# Altium schematic sheet ESC_V1.SchDoc: Electronic Speed Controller V1
size 381 x 241 mm; Date: 7 Maret 2025; Author: Ahmad Hanif Abiyyu Khrisna; DrawnBy: Ahmad Hanif Abiyyu Khrisna; Organization: PENS; SheetNumber: 1; SheetTotal: 1; SheetBerapa: 1; DariTotalSheet: 1; SizeKertas: A3
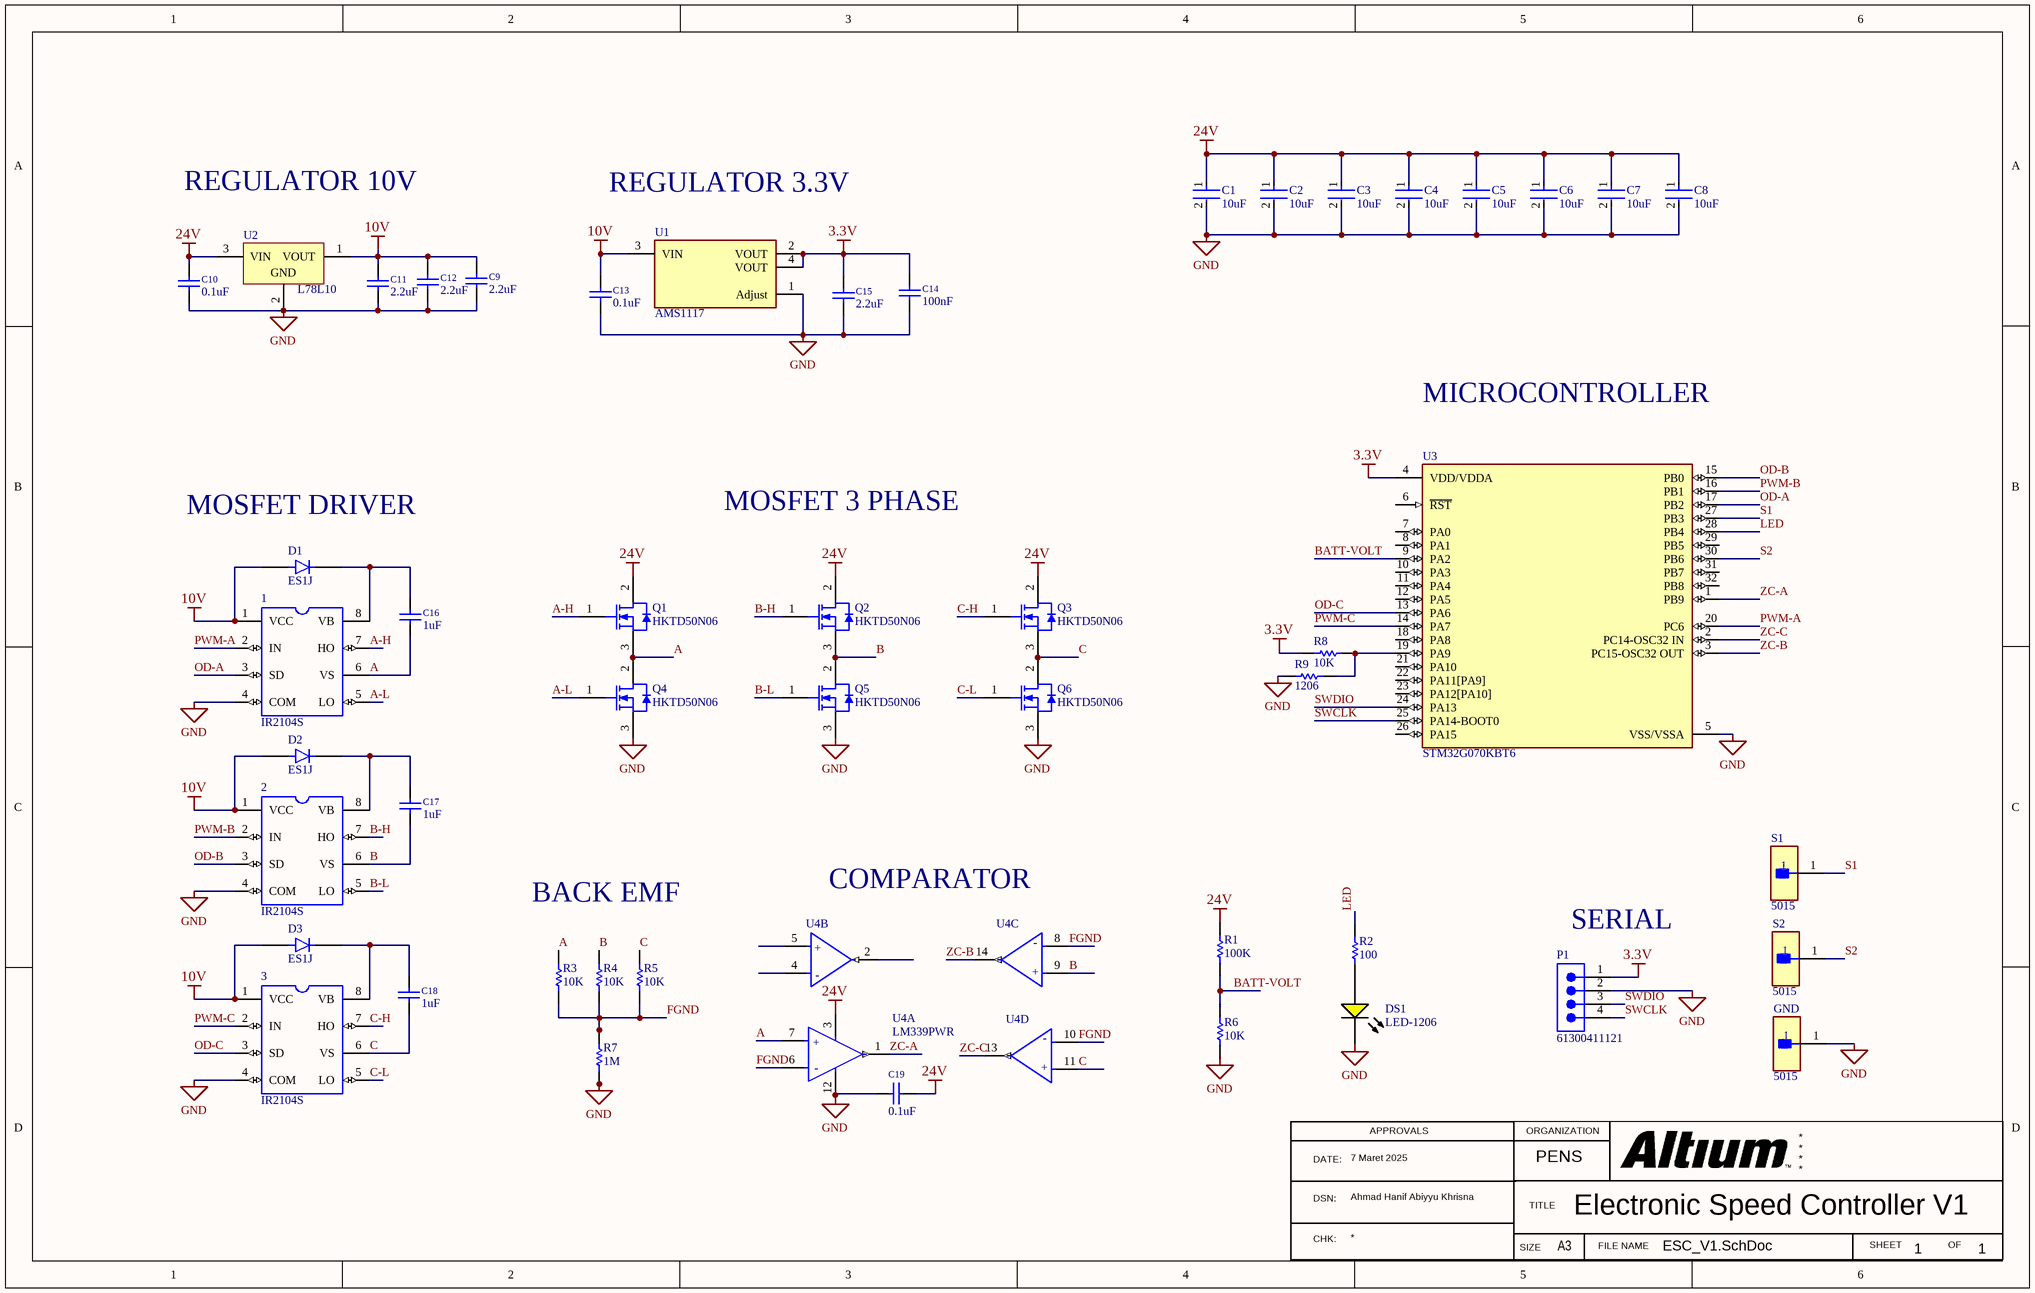
[diagram p0: ESC_V1.SchDoc]

## Parts
1  IR2104S  [IR2104S]
2  IR2104S  [IR2104S]
3  IR2104S  [IR2104S]
C1  10uF  [FP-C1206C-EB-IPC_A]
C2  10uF  [FP-C1206C-EB-IPC_A]
C3  10uF  [FP-C1206C-EB-IPC_A]
C4  10uF  [FP-C1206C-EB-IPC_A]
C5  10uF  [FP-C1206C-EB-IPC_A]
C6  10uF  [FP-C1206C-EB-IPC_A]
C7  10uF  [FP-C1206C-EB-IPC_A]
C8  10uF  [FP-C1206C-EB-IPC_A]
C9  2.2uF  [C2012-0805]
C10  0.1uF  [C2012-0805]
C11  2.2uF  [C2012-0805]
C12  2.2uF  [C2012-0805]
C13  0.1uF  [C2012-0805]
C14  100nF  [C2012-0805]
C15  2.2uF  [C2012-0805]
C16  1uF  [C2012-0805]
C17  1uF  [C2012-0805]
C18  1uF  [C2012-0805]
C19  0.1uF  [C2012-0805]
D1  ES1J  [DIO_ES1J]
D2  ES1J  [DIO_ES1J]
D3  ES1J  [DIO_ES1J]
DS1  LED-1206  [LUMX-SML-LX1206YC-TR_V]
GND  5015  [FP-5015-MFG]
P1  61300411121  [61300411121]
Q1  HKTD50N06  [INF-PG-TO252-3-313_L]
Q2  HKTD50N06  [INF-PG-TO252-3-313_L]
Q3  HKTD50N06  [INF-PG-TO252-3-313_L]
Q4  HKTD50N06  [INF-PG-TO252-3-313_L]
Q5  HKTD50N06  [INF-PG-TO252-3-313_L]
Q6  HKTD50N06  [INF-PG-TO252-3-313_L]
R1  100K  [RESC2013X50X30NL20T20]
R2  100  [RESC3216X70X50NL05T20]
R3  10K  [RESC2013X50X30NL20T20]
R4  10K  [RESC2013X50X30NL20T20]
R5  10K  [RESC2013X50X30NL20T20]
R6  10K  [RESC2013X50X30NL20T20]
R7  1M  [RESC2013X50X30NL20T20]
R8  10K  [RESC2013X50X30NL20T20]
R9  1206  [RESC3216X70X50NL05T20]
S1  5015  [FP-5015-MFG]
S2  5015  [FP-5015-MFG]
U1  AMS1117  [FP-ams1117-IPC_B]
U2  L78L10  [SOT-89_M]
U3  STM32G070KBT6  [FP-LQFP32-5V-MFG]
U4  LM339PWR  [FP-PW0014A-IPC_A]  (parts A,B,C,D of 4)

## Nets
3.3V: C14.1 C15.1 P1.1 R8.2 U1.2(VOUT) U1.4(VOUT) U3.4(VDD/VDDA)
10V: 1.1(VCC) 2.1(VCC) 3.1(VCC) C9.1 C11.1 C12.1 C13.1 D1.A D2.A D3.A U1.3(VIN) U2.1(VOUT)
24V: C1.1 C2.1 C3.1 C4.1 C5.1 C6.1 C7.1 C8.1 C10.1 C19.1 Q1.2(DRAIN) Q2.2(DRAIN) Q3.2(DRAIN) R1.2 U2.3(VIN) U4.3(VCC)
GND: 1.4(COM) 2.4(COM) 3.4(COM) C1.2 C2.2 C3.2 C4.2 C5.2 C6.2 C7.2 C8.2 C9.2 C10.2 C11.2 C12.2 C13.2 C14.2 C15.2 C19.2 DS1.2(K) GND.1 P1.2 Q4.3(SOURCE) Q5.3(SOURCE) Q6.3(SOURCE) R6.1 R7.1 R9.1 U1.1(Adjust) U2.2(GND) U3.5(VSS/VSSA) U4.12(GND)
A: 1.6(VS) C16.2 Q1.3(SOURCE) Q4.2(DRAIN) R3.2 U4.7(1IN+)
A-H: 1.7(HO) Q1.1(GATE)
A-L: 1.5(LO) Q4.1(GATE)
B: 2.6(VS) C17.2 Q2.3(SOURCE) Q5.2(DRAIN) R4.2 U4.9(3IN+)
B-H: 2.7(HO) Q2.1(GATE)
B-L: 2.5(LO) Q5.1(GATE)
BATT-VOLT: R1.1 R6.2 U3.9(PA2)
C: 3.6(VS) C18.2 Q3.3(SOURCE) Q6.2(DRAIN) R5.2 U4.11(4IN+)
C-H: 3.7(HO) Q3.1(GATE)
C-L: 3.5(LO) Q6.1(GATE)
FGND: R3.1 R4.1 R5.1 R7.2 U4.6(1IN-) U4.8(3IN-) U4.10(4IN-)
LED: R2.2 U3.28(PB4)
OD-A: 1.3(SD) U3.17(PB2)
OD-B: 2.3(SD) U3.15(PB0)
OD-C: 3.3(SD) U3.13(PA6)
PWM-A: 1.2(IN) U3.20(PC6)
PWM-B: 2.2(IN) U3.16(PB1)
PWM-C: 3.2(IN) U3.14(PA7)
S1: S1.1 U3.27(PB3)
S2: S2.1 U3.30(PB6)
SWCLK: P1.4 U3.25(PA14-BOOT0)
SWDIO: P1.3 U3.24(PA13)
ZC-A: U3.1(PB9) U4.1(1OUT)
ZC-B: U3.3(PC15-OSC32_OUT) U4.14(OUT3)
ZC-C: U3.2(PC14-OSC32_IN) U4.13(OUT4)
Net1_8: 1.8(VB) C16.1 D1.K
Net2_8: 2.8(VB) C17.1 D2.K
Net3_8: 3.8(VB) C18.1 D3.K
NetDS1_1: DS1.1(A) R2.1
NetR8_1: R8.1 R9.2 U3.19(PA9)

Not connected (* = marked no-connect by the designer): U3 6(~{RST}) 7(PA0) 8(PA1) 10(PA3) 11(PA4) 12(PA5) 18(PA8) 21(PA10) 22(PA11[PA9]) 23(PA12[PA10]) 26(PA15) 29(PB5) 31(PB7) 32(PB8); U4 2(2OUT) 4(2IN-) 5(2IN+)

## Notes on the sheet
- REGULATOR 10V
- REGULATOR 3.3V
- MICROCONTROLLER
- (near D1) MOSFET DRIVER
- MOSFET 3 PHASE
- BACK EMF
- (near U4) COMPARATOR
- (near P1) SERIAL
- DATE:
- APPROVALS
- ORGANIZATION
- DSN:
- CHK:
- SIZE
- TITLE
- FILE NAME
- SHEET
- OF
- (in symbol CMP-04896-000076-1, part A) +; -
- (in symbol CMP-04896-000076-1, part B) +; -
- (in symbol CMP-04896-000076-1, part C) -; +
- (in symbol CMP-04896-000076-1, part D) -; +

## Library data of the parts
1-3 = IR2104S: Half-Bridge Gate Driver IC Non-Inverting 8-SOIC; MF: Infineon Technologies; SnapEDA_Link: https://www.snapeda.com/parts/IR2104S/Infineon%20Technologies/view-part/582439/?ref=snap; Package: SO-8 Infineon; MP: IR2104S; Price: None; Value: *; Availability: Unavailable
C1-C8 = CMP-03020-000153-1: CAP CER 0.1UF 100V X7R 1206; Manufacturer: KEMET; Manufacturer Part Number: C1206C104K1RACTU; Value: 0.10 μF; Tolerance: 0.1; Material: Ceramic; Temperature Coefficient: 15%; Automotive Grade: Grade 0; Voltage Rating: 100 V; Automotive: Yes; Ipc Land Pattern Name: CAPC320160X78; Device Class L1: Passive Components; ComponentLink2Description: Datasheet; Temperature Range Low: -55°C; Category: Cap; Octopart: https://octopart.com/c1206c104k1ractu-kemet-89521; Height: 0.88mm; Lead Free: Yes; Digikey Description: CAP CER 0.1UF 100V X7R 1206; Mouser Description: CAP CER 0.1UF 100V X7R 1206; Device Class L3: Ceramic Capacitors; Device Class L2: Capacitors; ComponentLink2URL: https://content.kemet.com/datasheets/KEM_C1007_X8R_ULTRA_150C_SMD.pdf; Temperature Range High: +150°C; Temperature Characteristic: X7R; RoHS: TRUE; Capacitance: 0.10 μF; Package: C1206C-EB; Temperature: -55°C to +150°C
C9-C19 = Capacitor: AEMS Code: 2100341; Vendor: Digikey; Volt: 16V; Published: 13-April-2009; Publisher: Hoang Nguyen; ComponentLink1Description: Digikey Part Link; ComponentLink2Description: Open Datasheet; ComponentLink2URL: H:\LIBRARY\LIBRARY.Datasheet\
  C9 C11 C12 C15: Value: 2.2uF
  C10 C13 C19: Value: 0.1uF
  C14: Value: 100nF
  C16-C18: Value: 1uF
D1-D3 = ES1J: Diode Standard 600V 1A Surface Mount SMA (DO-214AC); MF: ON Semiconductor; Arrow_Electronics-Purchase-URL: https://snapeda.com/shop?store=Arrow+Electronics&id=1637442; DigiKey-Purchase-URL: https://snapeda.com/shop?store=DigiKey&id=1637442; Package: SMA-2 ON Semiconductor; Availability: Good; SnapEDA_Link: https://www.snapeda.com/parts/ES1J/ON%20Semiconductor/view-part/1637442/?ref=snap; MP: ES1J; Mouser-Purchase-URL: https://snapeda.com/shop?store=Mouser&id=1637442; Value: *; Price: None; ES1J: https://www.snapeda.com/parts/ES1J/ON%20Semiconductor/view-part/1637442/?ref=eda
DS1 = CMP-2000-07124-1: Yellow LED, Water Clear Len, 585 nm, 2.1 V, -40 to 85 degC, 2-Pin SMD, RoHS, Tape and Reel; Manufacturer: Lumex; Product Training Modules: LEDsBenefitsofCustomLEDandLCDTechnology; Millicandela Rating: 6mcd; Catalog Drawings: SML-LX1206SeriesTopSML-LX1206SeriesSideSML-LX1206SeriesBottomSML-LX1206SeriesFootprint; Wavelength - Peak: 585nm; Other Names: 67-1358-2LU60357TRSMLLX1206YCTR; Lens Style/Size: RectanglewithFlatTop; Current - Test: 20mA; Lens Color: Colorless; Viewing Angle: 160°; Voltage - Forward (Vf) (Typ): 2.1V; Online Catalog: SML-LX1206RectanglewithFlatTop1206PackageLEDs; Mounting Type: SurfaceMount; Package Description: 2-Pin Surface Mount Device, Body 3.2 x 1.5 mm; Datasheet Version: Rev. K, 08/2012; Features: -; Color: Yellow; RoHS Information: RoHSCertofCompliance; Package Reference: SML-LX1206YC-TR; Supplier Device Package: 1206; Standard Package: 3,000; Series: -; Wavelength - Dominant: -; Package / Case: 1206(3216Metric); Mounting Technology: SurfaceMount; Height (Max): 1.10mm; Lens Transparency: Clear; Datasheet URL: http://www.lumex.com/content/files/ProductAttachment/SML-LX1206YC-TR.pdf; Family: LEDIndication-Discrete; Manufacturer URL: http://www.lumexinstruments.com/; Packaging: Tape&Reel(TR); Category: Optoelectronics; Size / Dimension: 3.20mmLx1.60mmW
GND S1 S2 = CMP-2000-05183-2: PC TEST POINT MINIATURE; Manufacturer: keystone; Number Of Contacts: 1; Conn Orientation: Straight; Category: Conn; Manufacturer Part Number: 5015; Digikey Description: PC TEST POINT MINIATURE; Automotive: No; Lead Free: Yes; Octopart: https://octopart.com/5015-keystone-3822; ComponentLink2URL: http://www.keyelco.com/product-pdf.cfm?p=1353; Package: 5015; RoHS: TRUE; Device Class L3: unset; Device Class L2: unset; Contact Material: Silver; Device Class L1: Connectors; Height: 1.65mm; ComponentLink2Description: Datasheet
P1 = CMP-1502-01064-3: NexarPartId: 32855522; Operating Supply Voltage: 250V; Pitch: 2.54mm; Contact Resistance: 20mΩ; Number of Positions: 4; Current Rating: 3A; Connector Type: Male Pin; Gender: Male; Contact Plating: Gold; Height: 8.89mm; Lead Pitch: 2.54mm; Lead Free: Lead Free; Contact Mating Length: 5.9944mm; Number of Rows: 1; Termination: Solder; Packaging: Bulk; REACH SVHC: Unknown; Min Operating Temperature: -40°C; RoHS: Compliant; Number of Contacts: 4; Voltage Rating: 250V; Color: Black; Max Operating Temperature: 105°C; Contact Material: Copper; Mount: Through Hole; Orientation: Vertical; Number of Pins: 4
Q1-Q6 = CMP-1164-00349-1: N-Channel CoolMOS E6 Power-Transistor, 600 V VDS, 7.3 A ID, -55 to 150 degC, PG-TO252-3-313, Reel, Green; Manufacturer: Infineon; PartNumber: IPD60R600C6; IDpuls (max): 19Â A; VDS (max): 600Â V; VGS(th) (min): 2.5Â V; Ptot (max): 63Â W; Rth: 2Â K/W; VGS(th) (max): 3.5Â V; QG: 20.5Â nC; Green: TRUE; RDS (on) (max): 600Â mOhm; ID (max): 7.3Â A; RthJA (max): 62Â K/W; Polarity: N; Packing: Reel; PackageVersion: Oct-10; ComponentLink3Description: Package Specification; ComponentLink3URL: http://www.infineon.com/dgdl/PG-TO252-3-313-Package_Overview.pdf?folderId=db3a30432b57a660012b81890ade72d2&fileId=db3a30432b57a660012b8193af2872eb; Mounting Technology: Surface Mount; Technology: CoolMOS C6; PackageDescription: 3-Pin Plastic (Green) Transistor Single Outline Package, 6.5 x 6.12 mm Body, 2.28 mm Pitch; ComponentLink2Description: Datasheet; RthJC (max): 2Â K/W; ComponentLink1Description: Manufacturer URL; ComponentLink1URL: http://www.infineon.com/; ComponentLink2URL: http://www.infineon.com/dgdl/IPD60R600C6_2_0.pdf?folderId=db3a30431ff98815012019af55de3f2c&fileId=db3a30432239cccd0122a83152b97d6f; PackageReference: PG-TO252-3-313; DatasheetVersion: Rev. 2.0
R1 R3-R8 = CMP-2001-04915-1: Manufacturer: Vishay Dale; Part Number: CRCW080510R0FKEA
R2 R9 = CMP-2003-00541-1: Manufacturer: Panasonic; Part Number: ERJ-8GEY0R00V
U1 = CMP-209535-000002-1: 1A LOW DROPOUT VOLTAGE REGULATOR; RoHS Compliant: Yes
U2 = CMP-0244-00399-1: Positive Voltage Regulator, 10V, 4-Pin SOT-89, Tape and Reel; ComponentLink2Description: Datasheet; PackageVersion: 2011; ComponentLink1URL: http://www.st.com; DatasheetVersion: 1/02/2011; PackageDescription: 3-Pin SOT-89 Package 1.5 mm Pitch, 4.1 mm Lead Span; PackageReference: SOT-89; ComponentLink2URL: http://www.st.com/internet/com/TECHNICAL_RESOURCES/TECHNICAL_LITERATURE/DATASHEET/CD00000446.pdf; ComponentLink1Description: Manufacturer URL
U3 = CMP-12105-000041-1: MAINSTREAM VALUE LINE, ARM CORTE; Manufacturer: STMicroelectronics; Number Of Timers/Counters: 11; Memory Type: FLASH; Ram Size: 36KBytes; Memory Size: 128KBytes; Number Of Cores: 1; Core Architecture: ARM Cortex-M0+; Number Of Spi Channels: 2; Data Bus Width: 32bits; Max Supply Voltage: 3.6V; Standoff Height: 0.05mm; Max Junction Temp: +105°C; Nominal Supply Current: 0.3-6.9mA; Frequency: 64MHz; Number Of Adc Channels: 13; Number Of I/Os: 29; Min Supply Voltage: 2V; Interface: I2C,SPI,UART,USART,LIN,IrDA,I2S,SMBus,Other; Number Of Uart Channels: 4; Ambient Temperature Range High: +85°C; Automotive: No; Octopart: https://octopart.com/stm32g070kbt6-stmicroelectronics-97300430; Temperature: -40°C to +85°C; Temperature Range Low: -40°C; Package: LQFP32-5V; Manufacturer Part Number: STM32G070KBT6; Number Of I2C Channels: 2; Height: 1.6mm; Device Class L3: Microcontrollers; ComponentLink2URL: https://www.st.com/resource/en/datasheet/stm32g070kb.pdf; Device Class L2: Embedded Processors and Controllers; ComponentLink2Description: Datasheet; Number Of A/D Converters: 1; Temperature Range High: +85°C; Ambient Temperature Range Low: -40°C; Category: IC; Lead Free: Yes; Ipc Land Pattern Name: QFP80P900X900X160-32; Mouser Description: Cortex M0 128K LQFP32 85°C; RoHS: TRUE; Device Class L1: Integrated Circuits (ICs); Digikey Description: MAINSTREAM VALUE LINE, ARM CORTE
U4 = CMP-04896-000076-1: IC QUAD DIFF COMPARATOR 14-TSSOP; Supply Current: 2mA; Response Time: 1.3us; Max Supply Current: 500uA; Input Bias Current: 250nA; Max Dual Supply Voltage: 15V; Input Offset Voltage (Vos): 5mV; Number of Channels: 4; Output Type: TTL; Operating Supply Voltage: 28V; Voltage Gain: 106.02dB; Output Current: 20mA; Output Current per Channel: 6mA; Min Supply Voltage: 2V; Dual Supply Voltage: 9V; Quiescent Current: 2.5mA; Min Dual Supply Voltage: 1V; Max Supply Voltage: 30V; Contact Plating: Gold; REACH SVHC: No SVHC; Lead Free: Lead Free; Weight: 0.002018oz; Radiation Hardening: No; Number of Pins: 14; Packaging: Tape and Reel; Max Input Current: 250nA; Case/Package: TSSOP; RoHS Compliant: Yes; Mount: Surface Mount; Max Operating Temperature: 70°C; Number of Elements: 4; Package Quantity: 2000; Height: 1.15mm; Series: LM339; Length: 5mm; Width: 4.4mm; Nominal Supply Current: 2mA; Min Operating Temperature: 0°C; Technology: BIPOLAR